# EAGLE design m1-control (EAGLE 9.5.2)
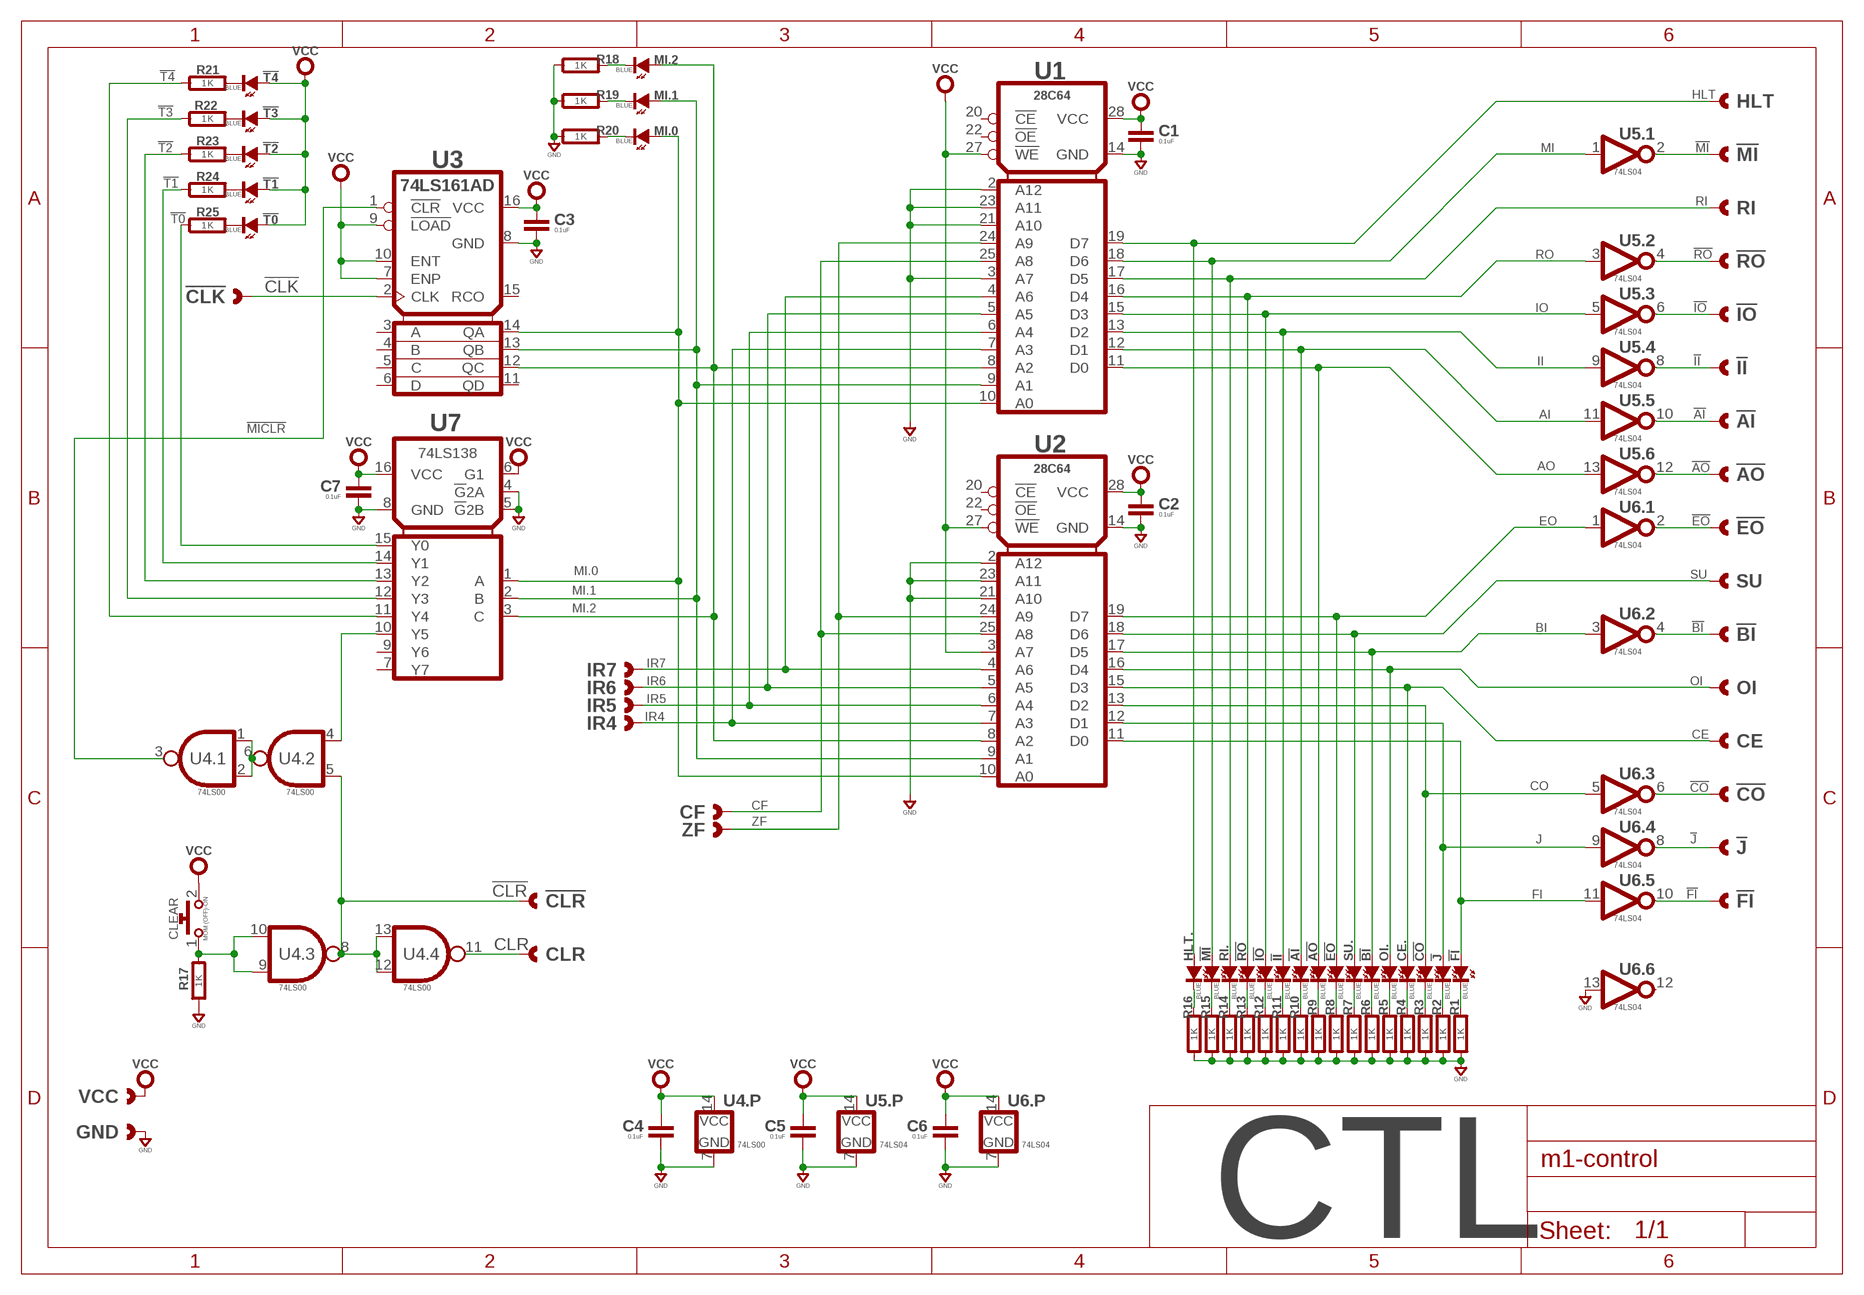
[diagram p0: schematic, sheet 1]

## Parts
!AI  CAST-01X1  [CAST01-2.54MM]
!AI!  BLUE  SMT0603  [SMD_0603]
!AO  CAST-01X1  [CAST01-2.54MM]
!AO!  BLUE  SMT0603  [SMD_0603]
!BI  CAST-01X1  [CAST01-2.54MM]
!BI!  BLUE  SMT0603  [SMD_0603]
!CLK  CAST-01X1  [CAST01-2.54MM]
!CLR  CAST-01X1  [CAST01-2.54MM]
!CO  CAST-01X1  [CAST01-2.54MM]
!CO!  BLUE  SMT0603  [SMD_0603]
!EO  CAST-01X1  [CAST01-2.54MM]
!EO!  BLUE  SMT0603  [SMD_0603]
!FI  CAST-01X1  [CAST01-2.54MM]
!FI!  BLUE  SMT0603  [SMD_0603]
!II  CAST-01X1  [CAST01-2.54MM]
!II!  BLUE  SMT0603  [SMD_0603]
!IO  CAST-01X1  [CAST01-2.54MM]
!IO!  BLUE  SMT0603  [SMD_0603]
!J  CAST-01X1  [CAST01-2.54MM]
!J!  BLUE  SMT0603  [SMD_0603]
!MI  CAST-01X1  [CAST01-2.54MM]
!MI!  BLUE  SMT0603  [SMD_0603]
!RO  CAST-01X1  [CAST01-2.54MM]
!RO!  BLUE  SMT0603  [SMD_0603]
!T0  BLUE  SMT0603  [SMD_0603]
!T1  BLUE  SMT0603  [SMD_0603]
!T2  BLUE  SMT0603  [SMD_0603]
!T3  BLUE  SMT0603  [SMD_0603]
!T4  BLUE  SMT0603  [SMD_0603]
C1  0.1uF  CAPACITOR0603  [0603-CAP]
C2  0.1uF  CAPACITOR0603  [0603-CAP]
C3  0.1uF  CAPACITOR0603  [0603-CAP]
C4  0.1uF  CAPACITOR0603  [0603-CAP]
C5  0.1uF  CAPACITOR0603  [0603-CAP]
C6  0.1uF  CAPACITOR0603  [0603-CAP]
C7  0.1uF  CAPACITOR0603  [0603-CAP]
CE  CAST-01X1  [CAST01-2.54MM]
CE.  BLUE  SMT0603  [SMD_0603]
CF  CAST-01X1  [CAST01-2.54MM]
CLEAR  MOM (OFF)-ON  TACTILE-2PSMD  [SWITCH-0635-2P-SMD]
CLR  CAST-01X1  [CAST01-2.54MM]
GND  CAST-01X1  [CAST01-2.54MM]
HLT  CAST-01X1  [CAST01-2.54MM]
HLT.  BLUE  SMT0603  [SMD_0603]
IR4  CAST-01X1  [CAST01-2.54MM]
IR5  CAST-01X1  [CAST01-2.54MM]
IR6  CAST-01X1  [CAST01-2.54MM]
IR7  CAST-01X1  [CAST01-2.54MM]
MI.0  BLUE  SMT0603  [SMD_0603]
MI.1  BLUE  SMT0603  [SMD_0603]
MI.2  BLUE  SMT0603  [SMD_0603]
OI  CAST-01X1  [CAST01-2.54MM]
OI.  BLUE  SMT0603  [SMD_0603]
R1  1K  RESISTOR0603  [0603-RES]
R2  1K  RESISTOR0603  [0603-RES]
R3  1K  RESISTOR0603  [0603-RES]
R4  1K  RESISTOR0603  [0603-RES]
R5  1K  RESISTOR0603  [0603-RES]
R6  1K  RESISTOR0603  [0603-RES]
R7  1K  RESISTOR0603  [0603-RES]
R8  1K  RESISTOR0603  [0603-RES]
R9  1K  RESISTOR0603  [0603-RES]
R10  1K  RESISTOR0603  [0603-RES]
R11  1K  RESISTOR0603  [0603-RES]
R12  1K  RESISTOR0603  [0603-RES]
R13  1K  RESISTOR0603  [0603-RES]
R14  1K  RESISTOR0603  [0603-RES]
R15  1K  RESISTOR0603  [0603-RES]
R16  1K  RESISTOR0603  [0603-RES]
R17  1K  RESISTOR0603  [0603-RES]
R18  1K  RESISTOR0603  [0603-RES]
R19  1K  RESISTOR0603  [0603-RES]
R20  1K  RESISTOR0603  [0603-RES]
R21  1K  RESISTOR0603  [0603-RES]
R22  1K  RESISTOR0603  [0603-RES]
R23  1K  RESISTOR0603  [0603-RES]
R24  1K  RESISTOR0603  [0603-RES]
R25  1K  RESISTOR0603  [0603-RES]
RI  CAST-01X1  [CAST01-2.54MM]
RI.  BLUE  SMT0603  [SMD_0603]
SU  CAST-01X1  [CAST01-2.54MM]
SU.  BLUE  SMT0603  [SMD_0603]
U1  28C64  28C64S  [SO28]
U2  28C64  28C64S  [SO28]
U3  74LS161AD  [SO16]
U4  74LS00  74LS00D  [SOP14]
U5  74LS04  74LS04D  [SOP14]
U6  74LS04  74LS04D  [SOP14]
U7  74LS138  74LS138D  [SO16]
VCC  CAST-01X1  [CAST01-2.54MM]
ZF  CAST-01X1  [CAST01-2.54MM]

## Nets
!AI: !AI.1 U5.10(.5:Y)
!AO: !AO.1 U5.12(.6:Y)
!BI: !BI.1 U6.4(.2:Y)
!CLK: !CLK.1 U3.2(CLK)
!CLR: !CLR.1 U4.5(.2:B) U4.8(.3:Y) U4.12(.4:B) U4.13(.4:A)
!CO: !CO.1 U6.6(.3:Y)
!EO: !EO.1 U6.2(.1:Y)
!FI: !FI.1 U6.10(.5:Y)
!II: !II.1 U5.8(.4:Y)
!IO: !IO.1 U5.6(.3:Y)
!J: !J.1 U6.8(.4:Y)
!MI: !MI.1 U5.2(.1:Y)
!MICLR: U3.1(!CLR) U4.3(.1:Y)
!RO: !RO.1 U5.4(.2:Y)
!T0: R25.1 U7.15(Y0)
!T1: R24.1 U7.14(Y1)
!T2: R23.1 U7.13(Y2)
!T3: R22.1 U7.12(Y3)
!T4: R21.1 U7.11(Y4)
AI: !AI!.A U1.12(D1) U5.11(.5:A)
AO: !AO!.A U1.11(D0) U5.13(.6:A)
BI: !BI!.A U2.17(D5) U6.3(.2:A)
CE: CE.1 CE..A U2.15(D3)
CF: CF.1 U1.25(A8) U2.25(A8)
CLR: CLR.1 U4.11(.4:Y)
CO: !CO!.A U2.13(D2) U6.5(.3:A)
EO: !EO!.A U2.19(D7) U6.1(.1:A)
FI: !FI!.A U2.11(D0) U6.11(.5:A)
GND: C1.2 C2.2 C3.2 C4.2 C5.2 C6.2 C7.2 GND.1 R1.1 R2.1 R3.1 R4.1 R5.1 R6.1 R7.1 R8.1 R9.1 R10.1 R11.1 R12.1 R13.1 R14.1 R15.1 R16.1 R17.1 R18.1 R19.1 R20.1 U1.2(A12) U1.3(A7) U1.14(GND) U1.21(A10) U1.23(A11) U2.2(A12) U2.14(GND) U2.21(A10) U2.23(A11) U3.8(GND) U4.7(.P:GND) U5.7(.P:GND) U6.7(.P:GND) U6.13(.6:A) U7.4(!G!2A) U7.5(!G!2B) U7.8(GND)
HLT: HLT.1 HLT..A U1.19(D7)
II: !II!.A U1.13(D2) U5.9(.4:A)
IO: !IO!.A U1.15(D3) U5.5(.3:A)
IR4: IR4.1 U1.7(A3) U2.7(A3)
IR5: IR5.1 U1.6(A4) U2.6(A4)
IR6: IR6.1 U1.5(A5) U2.5(A5)
IR7: IR7.1 U1.4(A6) U2.4(A6)
J: !J!.A U2.12(D1) U6.9(.4:A)
MI: !MI!.A U1.18(D6) U5.1(.1:A)
MI.0: MI.0.A U1.10(A0) U2.10(A0) U3.14(QA) U7.1(A)
MI.1: MI.1.A U1.9(A1) U2.9(A1) U3.13(QB) U7.2(B)
MI.2: MI.2.A U1.8(A2) U2.8(A2) U3.12(QC) U7.3(C)
N$20: !FI!.K(C) R1.2
N$28: !J!.K(C) R2.2
N$29: !CO!.K(C) R3.2
N$30: CE..K(C) R4.2
N$31: OI..K(C) R5.2
N$33: !BI!.K(C) R6.2
N$34: R7.2 SU..K(C)
N$35: !EO!.K(C) R8.2
N$36: !AO!.K(C) R9.2
N$37: !AI!.K(C) R10.2
N$38: !II!.K(C) R11.2
N$39: !IO!.K(C) R12.2
N$40: !RO!.K(C) R13.2
N$41: R14.2 RI..K(C)
N$42: !MI!.K(C) R15.2
N$43: HLT..K(C) R16.2
N$45: U4.1(.1:A) U4.2(.1:B) U4.6(.2:Y)
N$46: U4.4(.2:A) U7.10(Y5)
N$57: MI.2.K(C) R18.2
N$58: CLEAR.1 R17.2 U4.9(.3:B) U4.10(.3:A)
N$59: MI.1.K(C) R19.2
N$60: MI.0.K(C) R20.2
N$61: !T4.K(C) R21.2
N$62: !T3.K(C) R22.2
N$63: !T2.K(C) R23.2
N$64: !T1.K(C) R24.2
N$65: !T0.K(C) R25.2
OI: OI.1 OI..A U2.16(D4)
RI: RI.1 RI..A U1.17(D5)
RO: !RO!.A U1.16(D4) U5.3(.2:A)
SU: SU.1 SU..A U2.18(D6)
VCC: !T0.A !T1.A !T2.A !T3.A !T4.A C1.1 C2.1 C3.1 C4.1 C5.1 C6.1 C7.1 CLEAR.2 U1.27(!WE) U1.28(VCC) U2.3(A7) U2.27(!WE) U2.28(VCC) U3.7(ENP) U3.9(!LOAD) U3.10(ENT) U3.16(VCC) U4.14(.P:VCC) U5.14(.P:VCC) U6.14(.P:VCC) U7.6(G1) U7.16(VCC) VCC.1
ZF: U1.24(A9) U2.24(A9) ZF.1
Unconnected: U1.20(!CE) U1.22(!OE) U2.20(!CE) U2.22(!OE) U3.3(A) U3.4(B) U3.5(C) U3.6(D) U3.11(QD) U3.15(RCO) U6.12(.6:Y) U7.7(Y7) U7.9(Y6)

## Notes on the sheet
- CTL

## Library data of the parts
!AI !AO !CLK !CLR !EO !II !IO !MI !RO CF CLR GND HLT IR4-IR7 RI SU VCC ZF = con-headers:CAST-01X1: Castelated Edge Hole Pad
!AI! !AO! !BI! !CO! !EO! !FI! !II! !IO! !J! !MI! !RO! !T0 !T1-!T4 CE. HLT. MI.0 MI.1 MI.2 OI. RI. SU. = led:SMT: LED SMT
!BI !CO !FI !J CE OI = con-headers:CAST-01X1: Castelated Edge Hole Pad; SPICEPREFIX: X
C1-C7 = rlc:CAPACITOR: Capacitor CAP
CLEAR = switch-smd:TACTILE-2P: Pushbutton Switch, 2 pin, SPST, PCB Mount, THD; MFR: CK Switch; MPN: PTS635S*SMTR; MPN2: Pololu #1400
R1-R25 = rlc:RESISTOR: Resistor
U1 U2 = logic:28*64?: EEPROM 8K x 8; MFR: Microchip; MPN: AT28C64B-15SU
U3 = logic:74*161A?: Synchronous 4-bit Counter
U4 = logic:74*00?: Quad Nand Gate; MPN: 74LS00N
U5 U6 = logic:74*04?: Hex Inverter
U7 = logic:74*138?: 3 to 8 Decoder; MPN: 74LS138D

## Board
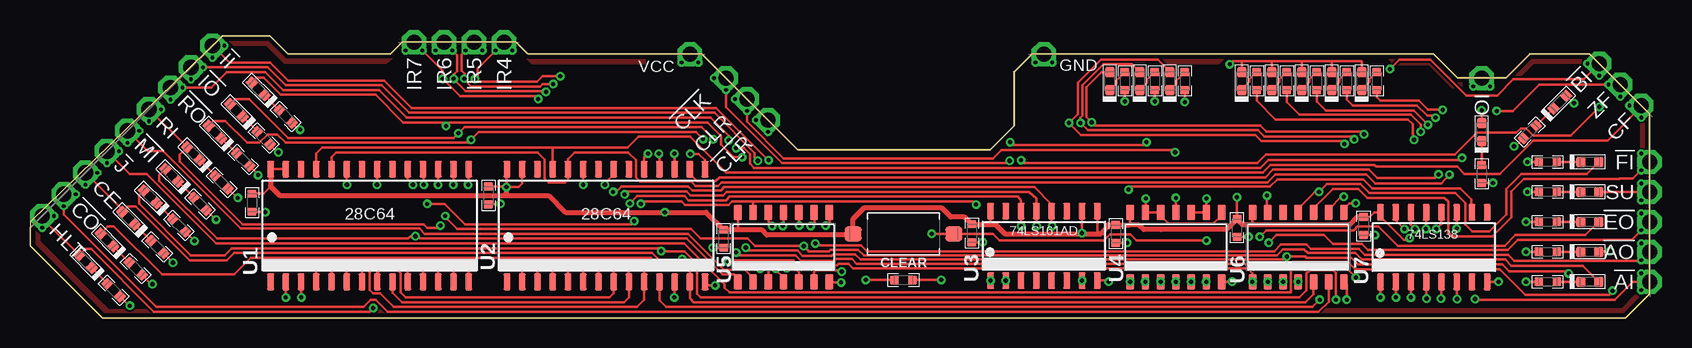
[diagram p1: board, top side]
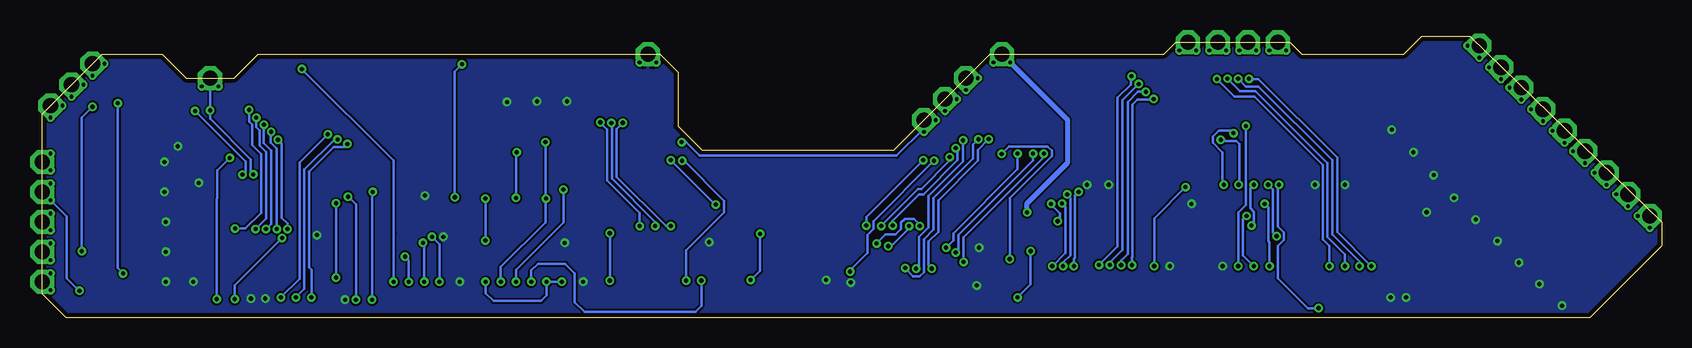
[diagram p2: board, bottom side, seen from below]

Size 135 x 23.5 mm. Coordinates in mm from the lower left corner, seen from the top.
Outline: 0,6 6,0 133,0 135,2 135,17 130,22 125,22 123,20 119,20 117,22 83.5,22 82,20.5 82,16 80,14 64,14 56,22 41.5,22 40.5,23 31,23 30,22 21.5,22 20,23.5 16,23.5 0,8 0,6
Copper layers (1*16): Top 0.0356mm / dielectric 1.5011mm / Bottom 0.0356mm
Design rules "OSH-CircuitMonkey *": minimum track width 6mil, minimum drill 13mil, track to track 6mil, track to pad 6mil, pad to pad 6mil, via to via 6mil, smd to smd 6mil, copper to edge 15mil, drill to drill 6mil, minimum pad ring 7mil, minimum via ring 7mil, stop-mask expansion 3mil, vias tented up to drill 14mil, thermal gap 10mil

### Footprints (pad centres in the part's own frame; a part is rotated, then mirrored left to right if it is on the bottom)
CAST01-2.54MM = drill 1.27 pad 2.032 octagon: 1 0,0 | drill 0.305 octagon: P$1 -0.7,0.7; P$2 -0.7,-0.7
SMD_0603 = smd 0.8 x 0.8: A 0.75,0; K -0.75,0
0603-CAP = smd 0.711 x 0.762: 1 -0.752,0; 2 0.752,0
SWITCH-0635-2P-SMD = smd 1.4 x 1.2: 1 -4.2,0; 2 4.2,0
0603-RES = smd 0.711 x 0.762: 1 -0.752,0; 2 0.752,0
SO28 = smd 0.6 x 1.4: 1 -8.255,-4.7; 2 -6.985,-4.7; 3 -5.715,-4.7; 4 -4.445,-4.7; 5 -3.175,-4.7; 6 -1.905,-4.7; 7 -0.635,-4.7; 8 0.635,-4.7; 9 1.905,-4.7; 10 3.175,-4.7; 11 4.445,-4.7; 12 5.715,-4.7; 13 6.985,-4.7; 14 8.255,-4.7; 15 8.255,4.7; 16 6.985,4.7; 17 5.715,4.7; 18 4.445,4.7; 19 3.175,4.7; 20 1.905,4.7; 21 0.635,4.7; 22 -0.635,4.7; 23 -1.905,4.7; 24 -3.175,4.7; 25 -4.445,4.7; 26 -5.715,4.7; 27 -6.985,4.7; 28 -8.255,4.7
SO16 = smd 0.6 x 1.4: 1 -4.445,-2.9; 2 -3.175,-2.9; 3 -1.905,-2.9; 4 -0.635,-2.9; 5 0.635,-2.9; 6 1.905,-2.9; 7 3.175,-2.9; 8 4.445,-2.9; 9 4.445,2.9; 10 3.175,2.9; 11 1.905,2.9; 12 0.635,2.9; 13 -0.635,2.9; 14 -1.905,2.9; 15 -3.175,2.9; 16 -4.445,2.9
SOP14 = smd 1.27 x 0.635: 1 -2.9,3.81; 2 -2.9,2.54; 3 -2.9,1.27; 4 -2.9,0; 5 -2.9,-1.27; 6 -2.9,-2.54; 7 -2.9,-3.81; 8 2.9,-3.81; 9 2.9,-2.54; 10 2.9,-1.27; 11 2.9,0; 12 2.9,1.27; 13 2.9,2.54; 14 2.9,3.81

### Placement (x,y rotation side)
!AI  135,3 0 top
!AI!  130,3 0 top
!AO  135,5.5 0 top
!AO!  130,5.5 0 top
!BI  130.8,21.2 45 top
!BI!  127.5,18 45 top
!CLK  58,20 45 top
!CLR  61.5,16.5 45 top
!CO  2.8,10.3 135 top
!CO!  6.4,6.5 135 top
!EO  135,8 0 top
!EO!  130,8 0 top
!FI  135,13 0 top
!FI!  130,13 0 top
!II  15.2,22.7 135 top
!II!  19,19.1 135 top
!IO  13.4,20.9 135 top
!IO!  17.2,17.3 135 top
!J  6.4,13.9 135 top
!J!  10,10.1 135 top
!MI  8.1,15.6 135 top
!MI!  11.8,11.9 135 top
!RO  11.7,19.2 135 top
!RO!  15.4,15.5 135 top
!T0  101,19.75 90 top
!T1  103.5,19.75 90 top
!T2  106,19.75 90 top
!T3  108.5,19.75 90 top
!T4  111,19.75 90 top
C1  18.5,9.6 270 top
C2  38.2,10.2 270 top
C3  78.5,7.05 270 top
C4  90.5,7 270 top
C5  57.8,6.6 270 top
C6  100.6,7.5 270 top
C7  111.15,7.65 270 top
CE  4.6,12.1 135 top
CE.  8.2,8.3 135 top
CF  134.3,17.7 45 top
CLEAR  72.8,7 180 top
CLR  59.75,18.25 45 top
GND  84.5,22 90 top
HLT  1,8.5 135 top
HLT.  4.6,4.7 135 top
IR4  39.5,23 90 top
IR5  37,23 90 top
IR6  34.5,23 90 top
IR7  32,23 90 top
MI.0  95,19.75 90 top
MI.1  92.5,19.75 90 top
MI.2  90,19.75 90 top
OI  121,20 90 top
OI.  121,15.5 90 top
R1  126.5,13 0 top
R2  12.4,7.7 135 top
R3  8.8,4.1 135 top
R4  10.6,5.9 135 top
R5  121,12 90 top
R6  125,15.5 45 top
R7  126.5,10.5 0 top
R8  126.5,8 0 top
R9  126.5,5.5 0 top
R10  126.5,3 0 top
R11  21.3,16.8 135 top
R12  19.45,15 135 top
R13  17.75,13.2 135 top
R14  15.95,11.3 135 top
R15  14.15,9.5 135 top
R16  6.95,2.3 135 top
R17  72.8,3.15 0 top
R18  91.25,19.75 90 top
R19  93.75,19.75 90 top
R20  96.25,19.75 90 top
R21  112.25,19.75 90 top
R22  109.75,19.75 90 top
R23  107.25,19.75 90 top
R24  104.75,19.75 90 top
R25  102.25,19.75 90 top
RI  9.9,17.4 135 top
RI.  13.6,13.7 135 top
SU  135,10.5 0 top
SU.  130,10.5 0 top
U1  28.3,7.7 0 top
U2  48,7.7 0 top
U3  84.5,6 0 top
U4  95.5,5.9 90 top
U5  62.8,5.9 90 top
U6  105.7,5.9 90 top
U7  117,5.9 0 top
VCC  55,22 90 top
ZF  132.55,19.45 45 top

### Tracks (layer width: path | path; a pad name or v marks a point on that pad's centre or on a via)
!AI  (via drill 0.35)
  Top 0.2: U5.10 64.1,8.77 v64.1,7.7 | v58.85,14.15 59.5,14.15 60,13.65 60,12.85 60.35,12.5 102.55,12.5 103.2,13.15 119.17,13.15 v119.36,13.34 | v120.45,1.55 120.5,1.5 132.1,1.5 133.6,3 !AI.1
  Bottom 0.2: v58.85,14.15 58.7,14 58.7,13.15 61.55,10.3 61.89,10.3 64.1,8.09 v64.1,7.7 | v120.45,1.55 120.45,9.89 120.39,9.95 120.39,12.3 v119.36,13.34
!AO  (via drill 0.35)
  Top 0.2: U5.12 61.53,8.03 61.85,7.71 v61.85,7.66 | v65.45,6.2 65.6,6.05 69.25,6.05 69.74,5.56 103.71,5.56 104.25,6.1 106.4,6.1 106.74,5.76 110.74,5.76 111.25,5.26 123.19,5.26 123.7,4.75 134.25,4.75 !AO.1
  Bottom 0.2: v61.85,7.66 61.85,7.8 62.31,8.27 63.09,8.27 63.4,7.96 63.4,7.4 63.85,6.95 64.7,6.95 v65.45,6.2
!BI  (via drill 0.35)
  Top 0.2: U6.4 | v113.35,20.75 114.12,21.52 116.73,21.52 119.7,18.55 122.3,18.55 123.65,19.9 129.5,19.9 !BI.1
  Bottom 0.2: U6.4 105.7,7.04 105.7,7.05 105.7,13.1 v113.35,20.75
  other vias: 105.71,3
!CLK  (via drill 0.35)
  Top 0.2: !CLK.1 58,17.56 62.66,12.9 81.45,12.9 v81.65,13.11
  Bottom 0.2: v81.65,13.11 81.5,13.11 78.15,9.75 78.15,8.8 81.33,5.62 U3.2
  other vias: 81.33,3.1
!CLR  (via drill 0.35)
  Top 0.2: v81.7,14.65 81.95,14.4 92.8,14.4 v93.05,14.65 | v93,9.95 93,8.84 U4.13 U4.12 94.23,8.5 94.88,7.85 98.65,7.85 99.31,8.51 U4.8
  Bottom 0.2: !CLR.1 61.5,15.8 63.78,13.52 80.2,13.52 81.33,14.65 v81.7,14.65 81.73,14.65 | v93.05,14.65 93.05,10 | 93.05,10 v93,9.95 | U4.5 96.77,4.23 93.05,7.95 93.05,10
  other vias: 96.77,3
!CO
  Top 0.2: !CO.1 2.8,8.6 10.5,0.9 27.8,0.9 28.4,1.5 28.8,1.5 29.8,0.5 107.4,0.5 108.24,1.34 U6.6
!EO  (via drill 0.35)
  Top 0.2: v103.25,6.25 103.9,6.9 107.85,6.9 108.6,6.15 111,6.15 111.49,5.66 123.16,5.66 124,6.5 133.5,6.5 !EO.1
  Bottom 0.2: U6.2 103.16,6.16 v103.25,6.25
  other vias: 103.16,3
!FI
  Top 0.2: U6.10 106.97,9.12 108.6,10.75 110.7,10.75 111.45,10 117.89,10 118.2,9.69 118.2,7.1 118.5,6.8 121.9,6.8 123.45,8.35 123.45,10.55 124.5,11.6 132.45,11.6 133.6,11.6 !FI.1
!II  (via drill 0.35)
  Top 0.2: 15.3,22.7 !II.1 16.61,21.29 20.01,21.29 21.5,19.8 29.5,19.8 31.8,17.5 57.16,17.5 61.5,13.16 v61.55,13.16 | U5.8 66.61,8 v66.31,7.7
  Bottom 0.2: v66.31,7.7 66.31,8.39 v61.55,13.16
!IO  (via drill 0.35)
  Top 0.2: v60.65,13.11 60.4,13.36 60.4,13.75 57.05,17.1 31.6,17.1 29.3,19.4 21.3,19.4 19.8,20.9 !IO.1 | U5.6 65.34,3.8 65.49,3.95 67.55,3.95 v67.65,3.85
  Bottom 0.2: v60.65,13.11 65.7,8.05 65.7,7.4 66.2,6.9 66.2,5.4 67.65,3.95 v67.65,3.85
!J  (via drill 0.35)
  Top 0.2: !J.1 8.3,12 9.7,12 15.5,6.2 26.04,6.2 26.05,6.21 54.49,6.21 57.9,2.8 57.9,2.5 58.3,2.1 105.1,2.1 105.1,3.88 105.5,4.29 109.39,4.29 | 109.4,4.3 109.39,4.29 | 109.39,4.29 109.56,4.29 v110.5,3.35 | v110.5,9.55 109.96,9.55 109.51,9.1 U6.8
  Bottom 0.2: v110.5,3.35 v110.5,9.55
!MI
  Top 0.2: !MI.1 9.8,13.9 11.1,13.9 17.55,7.45 32.45,7.45 32.9,7 54.85,7 57.85,4 59.6,4 60.26,3.34 U5.2
!MICLR  (via drill 0.35)
  Bottom 0.2: U3.1 80.06,0.98 80.55,0.48 89.78,0.48 90.6,1.3 90.6,3.7 91.4,4.5 93.68,4.5 94.23,3.95 U4.3
  other vias: 80.06,3.1 94.23,3
!RO  (via drill 0.35)
  Top 0.2: !RO.1 15.1,19.2 16.4,20.5 19.6,20.5 21.1,19 29.1,19 31.4,16.7 56.7,16.7 58.24,15.16 v58.24,14.8 | v62.15,4.1 62.15,4 62.8,3.35 U5.4
  Bottom 0.2: v58.24,14.8 58.24,13.05 61.1,10.17 61.1,7.55 61.9,6.75 61.9,4.35 v62.15,4.1
!T0  (via drill 0.35)
  Top 0.2: U7.15 113.83,8.13 v114.56,7.4 | v115.35,14.86 115.25,14.95 115.25,16.16 114.86,16.55 103.8,16.55 102.25,18.1 R25.1
  Bottom 0.2: v114.56,7.4 114.56,7.85 115.05,8.34 115.05,14.55 v115.35,14.86
!T1  (via drill 0.35)
  Top 0.2: U7.14 115.09,7.76 v115.45,7.4 | v115.91,15.51 115.91,16.11 115.07,16.95 105.8,16.95 104.75,18 R24.1
  Bottom 0.2: v115.45,7.4 115.45,14.1 115.96,14.61 115.96,15.11 115.91,15.15 v115.91,15.51
!T2  (via drill 0.35)
  Top 0.2: U7.13 116.36,7.81 116.35,7.8 v116.35,7.4 | v116.52,16.12 115.33,17.3 108,17.3 107.25,18.05 R23.1
  Bottom 0.2: v116.35,7.4 115.9,7.85 115.9,13.95 116.52,14.57 v116.52,16.12
!T3  (via drill 0.35)
  Top 0.2: U7.12 117.64,7.83 v117.21,7.4 | v117.15,16.7 117,16.85 116.45,16.85 115.6,17.7 110.25,17.7 109.75,18.2 R22.1
  Bottom 0.2: v117.21,7.4 116.31,8.3 116.31,13.81 116.87,14.37 116.87,15.61 117.15,15.89 v117.15,16.7
!T4  (via drill 0.35)
  Top 0.2: U7.11 118.91,7.46 v118.92,7.45 | v117.75,17.35 116.5,17.35 115.75,18.1 112.55,18.1 112.25,18.4 R21.1
  Bottom 0.2: v118.92,7.45 118.07,7.45 116.77,8.75 116.77,13.67 117.5,14.4 117.5,16.1 117.75,16.36 117.75,16.95 117.75,16.96 v117.75,17.35
AAA
  pour Top: 16.6,23.1 19.9,23.1 21.4,21.6 30.17,21.6 29.67,21.2 21.2,21.2 19.7,22.7 17,22.7
AI  (via drill 0.35)
  Top 0.2: U1.12 34,3.02 v34,4.3 | v34.6,8.5 34.6,8.4 35.6,7.4 55.1,7.4 55.9,6.6 59.8,6.6 60.42,5.98 v64.48,5.98 64.78,5.68 64.85,5.6 64.9,5.55 66.6,5.55 66.73,5.68 69.02,5.68 69.49,5.21 103.91,5.21 104.41,5.71 106.19,5.71 106.5,5.4 110.45,5.4 111,4.85 122.96,4.85 123.48,4.33 129.42,4.33 !AI!.A | v62.74,7.66 62.8,7.72 U5.11
  Bottom 0.2: v34,4.3 34.9,5.2 34.9,8.2 v34.6,8.5 | v64.48,5.98 64.22,5.98 62.74,7.46 v62.74,7.66
AO  (via drill 0.35)
  Top 0.2: U1.11 32.74,4.26 v32.7,4.3 | v33.1,9.5 34.55,9.5 36.26,7.79 50.09,7.79 v50.35,8.05 | v50.9,9.5 51.1,9.7 54.3,9.7 54.6,9.4 58.2,9.4 58.5,9.7 60.3,9.7 | 60.3,9.7 60.26,9.66 U5.13 | v78.85,9.45 78.6,9.7 60.3,9.7 | v82.6,13.15 82.85,12.9 102.3,12.9 103,13.6 118.76,13.6 120.61,15.45 123.89,15.45 124.25,15.8 124.7,15.8 125.3,15.2 128.4,15.2 128.65,15.45 v130.8,17.59 v130.8,17.6 | !AO!.A 130.8,5.55 v131.7,5.55
  Bottom 0.2: v32.7,4.3 32.7,6.3 32.8,6.4 32.8,9.2 v33.1,9.5 | v50.35,8.05 50.15,8.25 50.15,8.7 50.9,9.45 v50.9,9.5 | v78.85,9.45 78.9,9.45 v82.6,13.15 | v131.7,5.55 131.7,16.7 v130.8,17.6
BBB
  pour Top: 41.4,21.6 41.8,21.2 51.3,21.2 51.3,21.6
  pour Top: 0.4,6.2 0.4,7.3 0.8,6.9 0.8,6.4 6.5,0.7 107,0.8 107.1,0.7 107.7,0.7 107.8,0.8 132.7,0.8 133.8,1.9 133.9,1.9 134.1,1.7 132.8,0.4 6.2,0.4
BI  (via drill 0.35)
  Top 0.2: U2.17 53.7,12.41 v53.7,13.7 | v59.65,5.85 59.9,5.6 63.95,5.6 64.4,5.15 66.8,5.15 66.95,5.3 68.75,5.3 69.2,4.85 104.5,4.85 v104.75,5.11 106.3,5.11 106.4,5.01 110.15,5.01 110.7,4.45 122.7,4.45 123.3,3.85 128.1,3.85 v128.25,3.7 | U6.3 v104.44,3 v104.45,2.99 | !BI!.A 128.66,17.9 v128.7,17.9
  Bottom 0.2: v53.7,13.7 53.7,12.4 59.05,7.05 59.05,6.45 v59.65,5.85 | v104.45,2.99 104.45,4.8 v104.75,5.11 | v128.7,17.9 128.7,4.15 v128.25,3.7
CE  (via drill 0.35)
  Top 0.2: CE.1 7.67,9.03 CE..A 8.14,9.3 8.8,9.3 13.3,4.8 16.4,4.8 17,5.4 51.84,5.4 52.75,4.49 53.55,4.49 53.56,4.5 53.95,4.5 v54.35,4.9 | v55.02,13.67 55.73,13.67 56.26,13.15 U2.15
  Bottom 0.2: v54.35,4.9 54.35,10 50.84,13.5 50.84,13.95 51.2,14.3 54.42,14.3 55.02,13.7 v55.02,13.67
CF
  Top 0.2: U1.25 23.86,13.7 24.35,14.2 43.5,14.2 | 43.5,14.2 49.8,14.2 50.7,15.1 55,15.1 58,12.1 102.75,12.1 103.4,12.75 112.05,12.75 112.2,12.6 118.95,12.6 119.55,12 122.5,12 125.3,14.8 131.5,14.8 134.3,17.6 CF.1 | U2.25 43.55,14.14 43.5,14.2
CLR  (via drill 0.35)
  Top 0.2: CLR.1 59.75,16.36 62.81,13.3 80.24,13.3 80.94,14 95.25,14 v95.45,13.8 | v95.5,10 U4.11
  Bottom 0.2: v95.45,13.8 95.5,13.75 v95.5,10
CO
  Top 0.2: !CO!.A 6.47,7.63 6.97,7.63 11,3.6 17,3.6 18.4,5 45.74,5 45.75,5.01 51.74,5.01 52.7,4.04 54.76,4.04 55,3.8 55,3.02 U2.13 54.98,1.62 55.3,1.3 106.3,1.3 106.97,1.97 U6.5
EO  (via drill 0.35)
  Top 0.2: U2.19 51.17,13.38 v51.5,13.7 | v58.2,4.65 58.34,4.8 63.65,4.8 64.1,4.35 67.25,4.35 67.4,4.5 68.2,4.5 68.6,4.1 101.5,4.1 101.89,3.71 U6.1 | v102.5,6.75 103.05,7.3 110.35,7.3 110.65,7.6 112.4,7.6 113.99,6.01 122.91,6.01 123.8,6.9 129.65,6.9 !EO!.A
  Bottom 0.2: v58.2,4.65 58.2,6.7 51.5,13.4 v51.5,13.7 | U6.1 101.89,6.14 v102.5,6.75
  other vias: 101.89,3
FFF
  pour Top: 94.4,21.6 94.8,21.2 99.1,21.2 99.5,21.6
FI  (via drill 0.35)
  Top 0.2: U2.11 52.45,1.46 53,0.9 106.9,0.9 v107.5,1.5 | U6.11 105.7,9.1 107.1,10.5 v107.45,10.5 108.1,11.15 110.9,11.15 111.65,10.4 118.8,10.4 119.62,9.58 119.62,7.8 120.22,7.2 121.65,7.2 123.05,8.6 123.05,10.75 124.3,12 129.75,12 !FI!.A
  Bottom 0.2: v107.5,1.5 107.5,10.45 v107.45,10.5
GGG
  pour Top: 113.2,21.6 113.7,21.1 116.6,21.1 118.5,19.2 119.4,19.2 119.4,19.6 118.9,19.6 116.9,21.6
GND  (via drill 0.35)
  Top 0.2: U1.2 21.32,1.71 v21.3,1.7 | U1.3 22.59,1.71 v22.6,1.7 | U1.14 36.55,4.26 v36.6,4.3 | C1.2 19.55,8.85 v19.6,8.8 | v112.1,6.9 C7.2 | C5.2 57.2,5.85 v56.9,5.85 | v79.4,6.3 C3.2 | U5.7 66.66,2.95 v67.6,2.95 | v91.45,6.25 C4.2 | R17.1 v69.65,3.15 | U3.8 89.8,3.1 v89.9,3 | U4.7 v100.2,3 | C6.2 v101.55,6.75 | U6.13 103.1,8.86 v103.1,10.2 | U6.7 109.75,2.76 v109.75,1.5 | U7.4 116.4,2.96 v116.4,1.6 | U7.5 117.64,1.63 v117.6,1.6 | v121.95,11.25 R5.1 | R10.1 v124.7,3 | R9.1 v124.7,5.5 | R8.1 v124.7,8 | R7.1 v124.8,10.5 | v124.8,13 R1.1 | R6.1 123.8,14.3 v123.7,14.3 | v122.4,3 U7.8 | U2.14 56.55,2.7 v57.1,2.7 | U2.21 48.63,11.93 47.9,11.2 v47.9,11.1 | v46.1,11.1 v46.09,11.11 U2.23 | U1.21 28.93,11.14 v28.9,11.1 | U1.23 v26.39,11.11 v26.4,11.1 | R11.1 22.4,15.7 v22.5,15.7 | R12.1 20.65,13.8 v20.7,13.8 | R13.1 19,11.95 v19,11.9 | R14.1 17.25,10 v17.3,10 | R15.1 15.45,8.2 v15.5,8.2 | R2.1 v13.7,6.4 | v13.7,6.4 | R4.1 v11.9,4.6 | v11.9,4.6 | R3.1 10.1,2.8 v10.2,2.8 | R16.1 8.25,1 v8.3,1 | C2.2 38.25,9.5 v39.2,9.5 | U2.2 41.02,4.29 v41,4.3 | R18.1 v91.25,18.05 | R19.1 v93.75,18.05 | R20.1 v96.25,18
  pour Bottom (rank 4): 6,0 0,6 0,7.5 16,23.5 20,23.5 21.5,22 30,22 31,23 40.5,23 41.5,22 56,22 64,14 80,14 82,16 82,20.5 83.5,22 117,22 119,20 123,20 125,22 130,22 135,17 135,2 133,0
HHH
  pour Top: 129.3,21.6 129.3,21.2 125.3,21.2 124.3,20.2 123.7,20.2 125.1,21.6
HLT  (via drill 0.35)
  Top 0.2: v28.6,0.8 28.3,0.5 10.3,0.5 5.07,5.73 4.57,5.73 HLT..A 1.58,7.72 1.58,7.75 1.1,8.23 1.1,8.4 HLT.1 | U1.19 31.48,11.52 v31.9,11.1
  Bottom 0.2: v31.9,11.1 32,11 32,7.6 31.5,7.1 31.5,6.5 32,6 32,3.3 29.5,0.8 v28.6,0.8
II  (via drill 0.35)
  Top 0.2: !II!.A 18.87,20.03 19.47,20.03 20.9,18.6 28.8,18.6 31.1,16.3 34.37,16.3 v34.66,16 34.96,16.3 56.45,16.3 57.6,15.15 57.6,14.45 58.65,13.41 v59.35,13.41 | U1.13 35.28,4.29 v35.3,4.3 | U5.9 65.4,8.74 65.4,8.01 v65.05,7.66
  Bottom 0.2: v35.3,4.3 35.3,8.77 34.66,9.41 v34.66,16 | v59.35,13.41 v59.35,13.4 59.35,13.1 61.7,10.75 62,10.75 65.05,7.71 v65.05,7.66
IO  (via drill 0.35)
  Top 0.2: !IO!.A 17.07,18.23 18.27,18.23 21.5,15 35.3,15 v35.7,15.4 36.2,15.9 55.96,15.9 v56.96,14.9 | U1.15 36.55,11.16 v36.5,11.1 | v63.05,4.15 63.72,4.15 64.07,3.8 U5.5
  Bottom 0.2: v36.5,11.1 36.6,11.2 36.6,13.8 37.4,14.6 37.4,15.1 36.9,15.6 35.9,15.6 v35.7,15.4 | v56.96,14.9 57.41,14.45 57.41,13.3 60.7,10.01 60.7,7.35 61.5,6.55 61.5,3.8 61.85,3.45 62.4,3.45 63.05,4.1 v63.05,4.15
IR4  (via drill 0.35)
  Top 0.2: U2.7 47.37,3.94 v46.9,4.4 | U1.7 27.66,4.27 v27.7,4.3 | v44.2,20.15 42.7,20.15 42.27,19.72 37.28,19.72 v37.08,19.92 37.28,20.12 37.28,20.78 IR4.1
  Bottom 0.2: v27.7,4.3 27.7,6 28.25,6.55 28.25,12.75 33.97,18.47 35.63,18.47 v37.08,19.92 | v46.9,4.4 45.35,5.95 45.35,18.35 44.25,19.45 44.25,20.1 v44.2,20.15
IR5  (via drill 0.35)
  Top 0.2: U2.6 46.09,4.3 v46,4.4 | U1.6 v26.39,4.29 v26.4,4.3 | v43.6,19.5 42.7,19.5 42.5,19.3 36.75,19.3 36.2,19.85 v36.2,19.95 36.2,20.35 35.95,20.6 35.95,21.95 IR5.1
  Bottom 0.2: v26.4,4.3 26.4,5.3 27.85,6.75 27.85,12.9 33.85,18.9 35.15,18.9 v36.2,19.95 | v46,4.4 46,4.6 44.95,5.65 44.95,18.16 v43.6,19.5
IR6  (via drill 0.35)
  Top 0.2: U1.5 25.12,4.22 v25.2,4.3 | U2.5 44.83,3.97 45.05,4.2 v45.05,4.39 | v43,18.85 42.95,18.9 36.3,18.9 35.3,19.9 v35.3,19.95 35.3,20.3 35.6,20.6 35.6,21.9 IR6.1
  Bottom 0.2: v25.2,4.3 25.2,4.7 27.45,6.95 27.45,13.15 33.6,19.3 34.65,19.3 v35.3,19.95 35.25,20 | v43,18.85 43.65,18.85 44.5,18 44.5,5.35 45.05,4.79 v45.05,4.39
IR7  (via drill 0.35)
  Top 0.2: U1.4 23.86,3.96 v24.2,4.3 | U2.4 43.55,4.25 43.7,4.39 v44.15,4.39 | v42.35,18.25 42.1,18.5 35.85,18.5 v34.4,19.95 34.4,20.6 IR7.1
  Bottom 0.2: v24.2,4.3 27.05,7.15 27.05,13.35 33.6,19.9 34.35,19.9 v34.4,19.95 | v42.35,18.25 42.4,18.2 43.7,18.2 44.1,17.8 44.1,5.1 44.15,5.04 v44.15,4.39
J  (via drill 0.35)
  Top 0.2: !J!.A 9.07,10.23 9.07,9.53 13.4,5.2 16.2,5.2 16.8,5.8 52.35,5.8 v52.6,5.55 54.55,5.55 55.6,4.5 55.6,2 55.9,1.7 105.8,1.7 106.4,2.3 106.4,3.68 106.65,3.94 108.65,3.94 108.84,3.74 v108.84,1.5 | v53.7,1.7 53.7,2.98 U2.12 | v109.5,10.1 109.29,10.1 108.24,9.05 U6.9
  Bottom 0.2: v52.6,5.55 52.6,2.8 v53.7,1.7 | v108.84,1.5 108.84,9.45 v109.5,10.1
JJJ
  pour Top: 134.6,16.2 134.2,16.2 134.2,14.2 134.6,14.2
MI  (via drill 0.35)
  Top 0.2: !MI!.A 10.77,11.93 10.77,11.43 15.6,6.6 31.5,6.6 31.7,6.8 v32.1,6.8 | v32.1,6.8 32.3,6.8 32.5,6.6 54.7,6.6 57.7,3.6 58.69,3.6 58.99,3.3 U5.1 | v32.1,6.8 v32.1,6.81 | v32.8,11.1 32.8,12.34 U1.18
  Bottom 0.2: v32.1,6.81 32.41,7.11 32.41,10.7 v32.8,11.1
MI.0  (via drill 0.35)
  Top 0.2: U1.10 31.48,4.03 31.1,4.4 28.9,4.4 28.3,3.8 28.3,2.33 28.58,2.05 29.15,2.05 30.3,0.9 50.6,0.9 51.17,1.47 U2.10 51.17,3.93 v50.8,4.3 | v49.99,9.54 50.6,10.15 54.55,10.15 54.9,9.8 58,9.8 58.3,10.1 82.35,10.1 82.59,9.8 U3.14 v82.6,7.65 | U7.1 v112.56,1.71 v112.55,1.7 | v109.55,14.5 109.3,14.75 102.65,14.75 102.15,15.25 87.61,15.25 v86.6,16.26 87.35,17.01 87.35,19.6 89.27,21.52 94,21.52 95,20.52 MI.0.A
  Bottom 0.2: v50.8,4.3 49.7,5.4 49.7,9.25 v49.99,9.54 | v82.6,7.65 83,7.65 87.1,11.75 87.1,15.76 v86.6,16.26 | v112.55,1.7 112.55,4 112.75,4.2 112.75,12.2 110.7,14.25 109.8,14.25 v109.55,14.5
MI.1  (via drill 0.35)
  Top 0.2: v49.55,10.3 49.8,10.55 54.7,10.55 55.05,10.2 57.75,10.2 58.05,10.5 83.25,10.5 83.86,9.93 U3.13 83.86,7.69 v83.9,7.65 | U1.9 30.2,2.1 31,1.3 49.5,1.3 49.91,1.71 U2.9 v49.9,4.3 | U7.2 113.83,1.72 v113.85,1.7 | v87.55,16.25 88.16,15.65 102.36,15.65 102.88,15.13 110.13,15.13 v110.38,14.88 | v87.55,16.25 87.75,16.45 | MI.1.A 91.83,21.17 89.45,21.17 87.7,19.42 87.7,16.86 87.55,16.71 v87.55,16.25
  Bottom 0.2: v49.55,10.3 49.55,10.2 49.3,9.95 49.3,5.2 49.9,4.6 v49.9,4.3 | v83.9,7.65 83.9,8 87.5,11.61 87.5,16.2 v87.55,16.25 | v113.85,1.7 113.15,2.4 113.15,12.36 110.63,14.88 v110.38,14.88
MI.2  (via drill 0.35)
  Top 0.2: U1.8 28.93,3.73 29.2,4 30.6,4 30.9,3.7 30.9,2.1 31.3,1.7 48.3,1.7 48.63,2.04 U2.8 48.63,3.94 v49,4.3 | v48.6,10.5 48.85,10.5 49.3,10.95 54.85,10.95 55.2,10.6 57.6,10.6 57.85,10.9 83.7,10.9 85.14,9.46 U3.12 85.14,7.72 v85.2,7.65 | U7.3 v115.09,1.71 v115.1,1.7 | 88.48,16.33 88.75,16.05 102.55,16.05 103.05,15.55 110.95,15.55 v111.2,15.3 | v88.48,16.3 v88.48,16.31 88.48,16.33 | MI.2.A 89.31,20.5 88.06,19.25 88.06,16.75 88.48,16.33
  Bottom 0.2: v49,4.3 49,4.9 48.9,5 48.9,10.2 v48.6,10.5 | v85.2,7.65 85.2,8.75 87.9,11.45 87.9,15.72 v88.48,16.3 | v115.1,1.7 113.55,3.25 113.55,12.95 v111.2,15.3
N$20
  Top 0.2: R1.2 !FI!.K
N$28
  Top 0.2: !J!.K R2.2
N$29
  Top 0.2: !CO!.K R3.2
N$30
  Top 0.2: CE..K R4.2
N$31
  Top 0.2: OI..K R5.2
N$33
  Top 0.2: !BI!.K R6.2
N$34
  Top 0.2: R7.2 SU..K
N$35
  Top 0.2: R8.2 !EO!.K
N$36
  Top 0.2: R9.2 !AO!.K
N$37
  Top 0.2: R10.2 !AI!.K
N$38
  Top 0.2: !II!.K R11.2
N$39
  Top 0.2: !IO!.K 18.92,15.58 R12.2
N$40
  Top 0.2: !RO!.K 17.17,13.73 R13.2
N$41
  Top 0.2: RI..K 15.42,11.88 R14.2
N$42
  Top 0.2: !MI!.K 13.62,10.08 R15.2
N$43
  Top 0.2: HLT..K 6.42,2.88 R16.2
N$45  (via drill 0.35)
  Bottom 0.2: U4.1 U4.2 92.96,1.85 93.41,1.4 97.39,1.4 98.04,2.05 U4.6
  other vias: 91.69,3 92.96,3 98.04,3
N$46  (via drill 0.35)
  Top 0.2: v91.55,10.7 91.8,10.95 103.35,10.95 103.95,11.55 111.15,11.55 111.9,10.8 119.2,10.8 120.15,9.85 120.15,8.82 U7.10
  Bottom 0.2: U4.4 95.5,4 91.55,7.95 v91.55,10.7
  other vias: 95.5,3
N$57
  Top 0.2: MI.2.K 90.55,19.55 90.55,19.8 R18.2
N$58  (via drill 0.35)
  Top 0.2: v98.05,6.45 92.2,6.45 91.7,6.95 90,6.95 89.5,6.45 80.8,6.45 80.25,7 CLEAR.1 v75.15,7 | R17.2 v75.95,3.15 | U4.10 U4.9 v98.04,9.94 v98.05,9.95
  Bottom 0.2: v75.95,3.15 75.9,3.15 75.15,3.9 v75.15,7 | v98.05,9.95 v98.05,6.45
N$59
  Top 0.2: MI.1.K 93.1,19.6 93.1,19.85 R19.2
N$60
  Top 0.2: MI.0.K 95.55,19.55 95.55,19.8 R20.2
N$61
  Top 0.2: !T4.K 111.65,19.65 111.65,19.9 R21.2
N$62
  Top 0.2: !T3.K 109.15,19.65 109.15,19.9 R22.2
N$63
  Top 0.2: !T2.K 106.65,19.65 106.65,19.9 R23.2
N$64
  Top 0.2: !T1.K 104.15,19.65 104.15,19.9 R24.2
N$65
  Top 0.2: !T0.K 101,19.05 101.65,19.7 101.65,19.9 R25.2
OI  (via drill 0.35)
  Top 0.2: U2.16 54.98,12.02 55.6,11.4 57.15,11.4 57.45,11.7 102.95,11.7 103.6,12.35 111.6,12.35 112.3,11.65 117.09,11.65 v117.4,11.95 | OI..A v121,17.3
  Bottom 0.2: OI.1 v121,17.3 121,16.61 117.6,13.2 117.6,12.16 v117.4,11.95
RI  (via drill 0.35)
  Top 0.2: RI.1 RI..A | RI..A | RI..A 12.47,13.63 12.47,13.03 17.7,7.8 32.8,7.8 33.1,7.5 34,7.5 v34.2,7.7 | U1.17 34.02,11.21 34,11.2 v34,11.1
  Bottom 0.2: v34,11.1 34.3,10.8 34.3,9.15 33.99,8.84 33.99,7.9 v34.2,7.7
RO  (via drill 0.35)
  Top 0.2: !RO!.A 15.27,16.43 16.27,16.43 18.1,14.6 19.1,14.6 19.8,15.3 20.6,15.3 21.3,14.6 36.5,14.6 v36.75,14.85 37.4,15.5 55.5,15.5 v56.1,14.9 | U1.16 35.28,11.12 v35.27,11.1 | v60.85,4.1 61.3,4.1 61.53,3.87 U5.3
  Bottom 0.2: v35.27,11.1 35.2,11.17 35.2,14.5 35.45,14.75 36.65,14.75 v36.75,14.85 | v56.1,14.9 57,14 57,13.1 60.3,9.8 60.3,7.15 61.1,6.35 61.1,4.35 v60.85,4.1
SU  (via drill 0.35)
  Top 0.2: U2.18 52.45,13.66 v52.4,13.7 | v58.85,5.45 59.1,5.2 63.8,5.2 64.25,4.75 67.05,4.75 67.2,4.9 68.5,4.9 68.9,4.5 105.12,4.5 105.27,4.65 109.85,4.65 110.45,4.05 122.5,4.05 124.65,1.9 131.64,1.9 131.9,2.15 v131.9,2.25 | SU.1 SU..A
  Bottom 0.2: v52.4,13.7 52.4,13.1 58.6,6.9 58.6,5.7 v58.85,5.45 | SU.1 132.95,8.45 132.95,3.3 v131.9,2.25
VCC  (via drill 0.35)
  Top 0.2: U2.3 42.28,4.29 v42.3,4.3 | v39.7,10.9 39.7,11 | 39.7,11 39.7,12.36 U2.28 | C2.1 39.65,10.95 | U2.27 41.02,11.21 40.7,10.9 39.8,10.9 39.7,11 | C1.1 19.45,10.35 20.05,10.95 | U1.27 U1.28 | v115,6.65 114.85,6.5 114.5,6.5 112.56,8.45 U7.16 112.05,8.8 111.65,8.4 C7.1 | v118.95,1.55 118.91,1.6 U7.6 | 101.74,8.65 U6.14 101.89,7.77 101.9,7.76 | U4.14 91.69,7.75 | 94.24,7.31 94.28,7.35 | U3.10 v87.67,7.05 87.67,7.03 87.7,7 | U3.9 88.94,7.11 89.05,7 | U3.16 80.06,7.81 80.05,7.8 | C6.1 v100.6,10.05 | !T4.A 111,21.35 110.95,21.4 108.5,21.4 | 108.5,21.4 106,21.4 | 106,21.4 103.5,21.4 | 103.5,21.4 101,21.4 | 101,21.4 100.25,21.4 v100,21.15 | !T3.A 108.5,21.4 | !T2.A 106,21.4 | !T1.A 103.5,21.4 | !T0.A 101,21.4
  Top 0.203: U5.14 59,7.35
  Top 0.4: U1.28 20.05,10.95 20.8,10.2 39.49,10.2 39.5,10.2 39.7,10.2 | 39.7,10.2 43.2,10.2 44.6,8.8 v52.9,8.8 56.36,8.8 C5.1 59,7.35 60.95,7.35 | 39.7,10.2 v39.7,10.9 39.65,10.95 | 100.85,8 C6.1 99.7,7.35 94.28,7.35 92.8,7.35 92.4,7.75 91.69,7.75 C4.1 89.87,7.75 89.24,7 89.05,7 87.7,7 81.25,7 80.45,7.8 80.05,7.8 C3.1 77.9,8.4 76.75,8.4 76,9.15 69.5,9.15 68.6,8.25 CLEAR.2 68.5,6.9 61.4,6.9 | C7.1 110.6,8.4 109.96,7.76 101.9,7.76 101.09,7.76
  Top 0.406: 101.09,7.76 100.85,8 | 60.95,7.35 61.4,6.9
  Bottom 0.2: v42.3,4.3 42.3,8.3 v39.7,10.9 | v115,6.65 118.95,2.7 v118.95,1.55 | U3.7 v87.67,7.05 | v100,21.15 100.6,20.55 v100.6,10.05
  Bottom 0.4: VCC.1 49.54,16.54 49.54,12.9 52.9,9.55 v52.9,8.8
  other vias: 87.67,3.1
ZF  (via drill 0.35)
  Top 0.2: U1.24 25.12,13.43 25.5,13.8 42.3,13.8 42.9,13.2 42.9,11.6 43.2,11.3 44.6,11.3 44.83,11.52 U2.24 44.83,13.23 45.4,13.8 49.85,13.8 50.5,13.15 50.5,11.7 50.85,11.35 55.1,11.35 55.45,11 57.35,11 57.65,11.3 103.15,11.3 103.8,11.95 111.4,11.95 112.15,11.2 117.63,11.2 v118.3,11.95 | v122.25,17.25 123.6,17.25 125.8,19.45 ZF.1
  Bottom 0.2: v118.3,11.95 118.05,12.2 118.05,13.05 v122.25,17.25

### Text on the board
tDocu: !II | IR.7 | IR.6 | IR.5 | IR.4 | Vcc | !IO | GND | OI | !CLK | !RO | CLR | RI | !MI | !CLR | !J | !FI | CE | SU | !CO | !EO | HLT | !AO | !AI
3D_REF_2: !II | IR.7 | IR.6 | IR.5 | IR.4 | Vcc | !IO | GND | OI | !BI | !CLK | !RO | ZF | CLR | CF | RI | !MI | !CLR | !J | !FI | CE | SU | !CO | !EO | HLT | !AO | !AI